# Altium schematic sheet tfcard.SchDoc
size A2
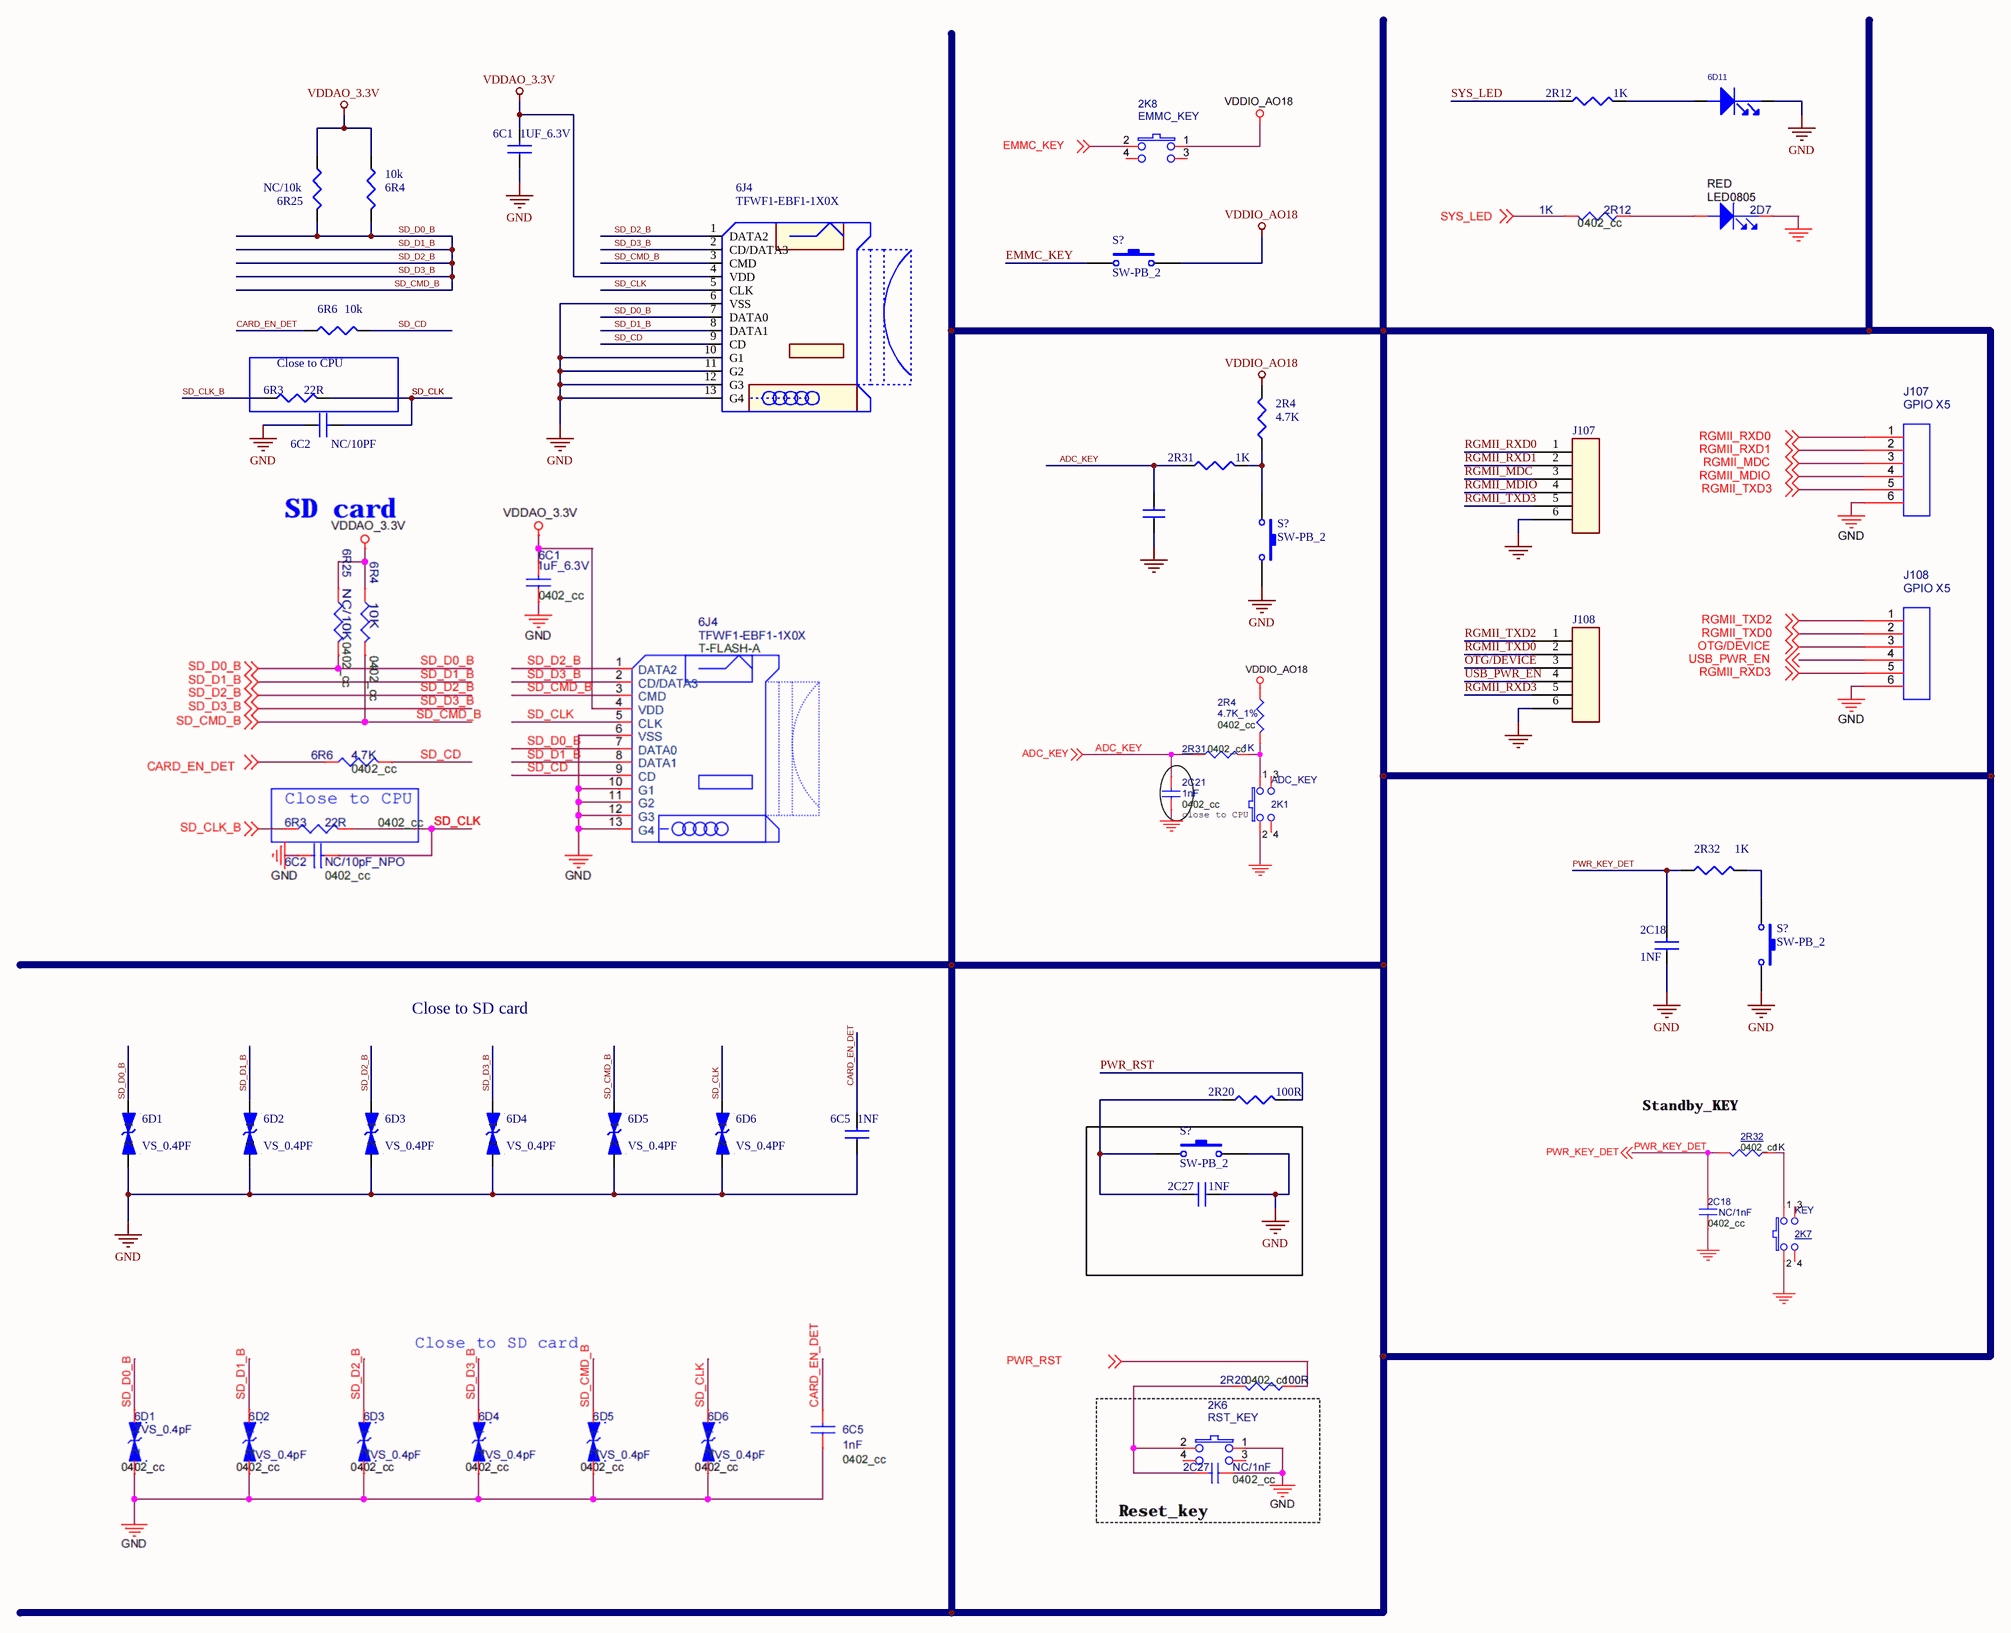
[diagram p0: tfcard.SchDoc]

## Parts
(Parts that share a designator on the sheet are numbered #1, #2 ... from top to bottom, then left to right.)
2C18  1NF
2C27  1NF
2R4  4.7K
2R12  1K
2R20  100R
2R31  1K
2R32  1K
6C1  1UF_6.3V
6C2  NC/10PF
6C5  1NF
6D1  VS_0.4PF
6D2  VS_0.4PF
6D3  VS_0.4PF
6D4  VS_0.4PF
6D5  VS_0.4PF
6D6  VS_0.4PF
6J4  TFWF1-EBF1-1X0X
6R3  22R
6R4  10k
6R6  10k
6R25  NC/10k
50  (no value)  [button]
51  (no value)  [button]
58  J102: 6D11
59  (no value)  [button]
61  (no value)  [button]
65  (no value)  [0603C]
J107  (no value)
J108  (no value)
S?#1  SW-PB_2  [SPST-2]
S?#2  SW-PB_2  [SPST-2]
S?#3  SW-PB_2  [SPST-2]
S?#4  SW-PB_2  [SPST-2]

## Blocks framed on the sheet
Close to CPU: 6R3

## Nets
GND: 2C18.1 2C27.1 6C1.1 6C2.1 6C5.1 6D1.2 6D2.2 6D3.2 6D4.2 6D5.2 6D6.2 6J4.6(VSS) 6J4.10(G1) 6J4.11(G2) 6J4.12(G3) 6J4.13(G4) 58.2 S?#2.2 S?#3.2 S?#4.2
Net65_1: 65.1 J107.6 J108.6
VDDAO_3.3V: 6C1.2 6J4.4(VDD) 6R4.1 6R25.1
VDDIO_AO18: 2R4.2 S?#1.2
ADC_KEY: 2R31.1 65.2
CARD_EN_DET: 6C5.2 6R6.1
EMMC_KEY: S?#1.1
OTG/DEVICE: J108.3
PWR_KEY_DET: 2C18.2 2R32.1
PWR_RST: 2R20.2
RGMII_MDC: J107.3
RGMII_MDIO: J107.4
RGMII_RXD0: J107.1
RGMII_RXD1: J107.2
RGMII_RXD3: J108.5
RGMII_TXD0: J108.2
RGMII_TXD2: J108.1
RGMII_TXD3: J107.5
SD_CD: 6J4.9(CD) 6R6.2
SD_CLK: 6C2.2 6D6.1 6J4.5(CLK) 6R3.2
SD_CLK_B: 6R3.1
SD_CMD_B: 6D1.1 6D2.1 6D3.1 6D4.1 6D5.1 6J4.1(DATA2) 6J4.2(CD/DATA3) 6J4.3(CMD) 6J4.7(DATA0) 6J4.8(DATA1) 6R4.2 6R25.2  [also labelled SD_D0_B, SD_D1_B, SD_D2_B, SD_D3_B]
SYS_LED: 2R12.1
USB_PWR_EN: J108.4
Net2C27_2: 2C27.2 2R20.1 S?#4.1
Net2R4_1: 2R4.1 2R31.2 S?#2.1
Net2R12_2: 2R12.2 58.1
Net2R32_2: 2R32.2 S?#3.1

## Notes on the sheet
- Close to SD card

## Library data of the parts
2C18 2C27 6C1 6C2 6C5 = CAP NP_6
2R4 2R12 2R20 2R31 2R32 6R3 6R4 6R6 6R25 = R
6D1-6D6 = TVS DIODE
6J4 = J-TF-CARD-PUSH
50 51 59 61 = BUTTON_0
58 = LED_3
65 = capnp: 1R42: 8R12
J107 J108 = CON6
S?#1-S?#4 = SW-PB_2: Switch; Published: 24-Mar-1999; LatestRevisionDate: 17-Jul-2002; LatestRevisionNote: Re-released for DXP Platform.; PackageReference: SPST-2; Publisher: Altium Limited; PackageDescription: Switch; 2 Leads